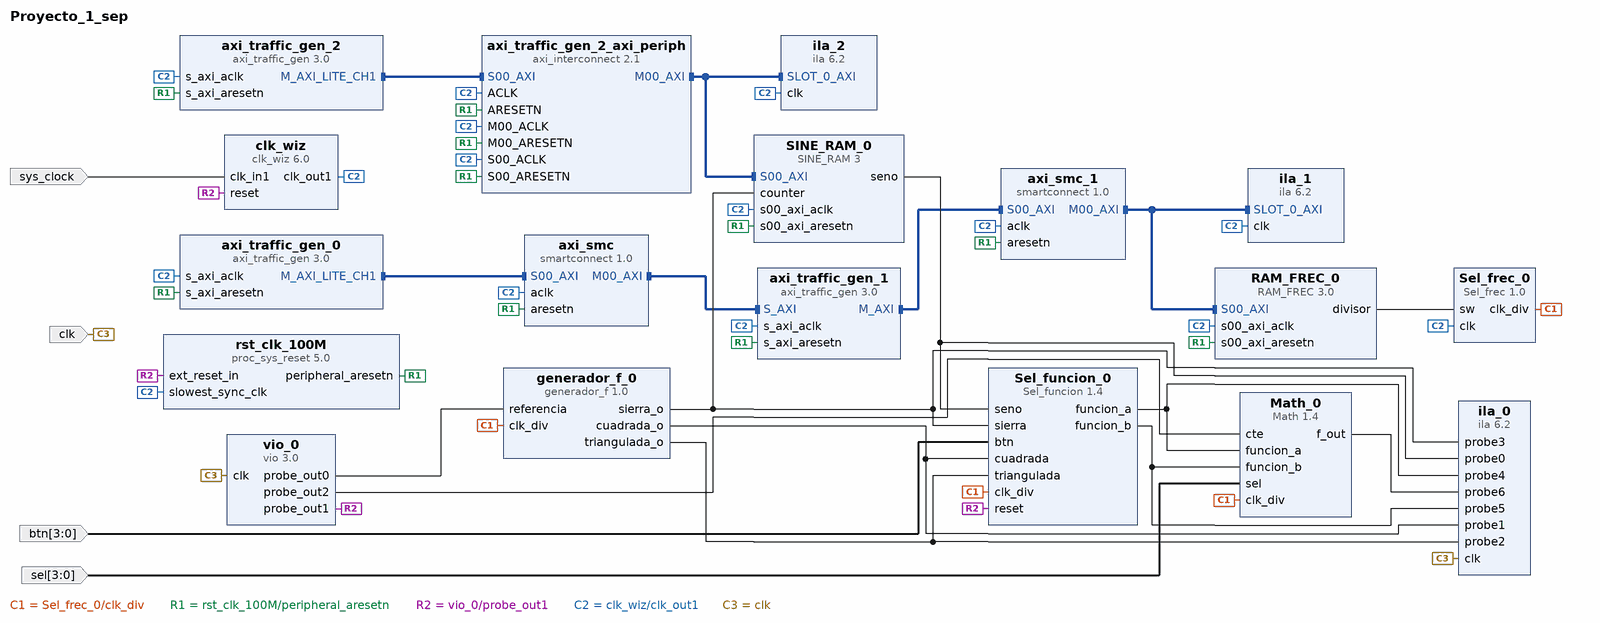
[diagram p0: block diagram of the top level]
# Vivado block design Proyecto_1_sep, xc7z010clg400-1, Vivado 2020.1
create_bd_design Proyecto_1_sep

create_bd_port -dir I -type clk clk
set_property -dict {CONFIG.FREQ_HZ 125000000} [get_bd_ports clk]
create_bd_port -dir I -from 3 -to 0 btn
create_bd_port -dir I -from 3 -to 0 sel
create_bd_port -dir I -type clk sys_clock
set_property -dict {CONFIG.FREQ_HZ 125000000 CONFIG.PHASE 0.000} [get_bd_ports sys_clock]

create_bd_cell -type ip -vlnv xilinx.com:user:Math:1.4 Math_0
create_bd_cell -type ip -vlnv xilinx.com:user:RAM_FREC:3.0 RAM_FREC_0
create_bd_cell -type ip -vlnv xilinx.com:user:SINE_RAM:3 SINE_RAM_0
create_bd_cell -type ip -vlnv xilinx.com:user:Sel_frec:1.0 Sel_frec_0
create_bd_cell -type ip -vlnv xilinx.com:user:Sel_funcion:1.4 Sel_funcion_0
create_bd_cell -type ip -vlnv xilinx.com:ip:axi_traffic_gen:3.0 axi_traffic_gen_0
set_property -dict [list \
  CONFIG.C_ATG_MIF_DATA_DEPTH 256 \
  CONFIG.C_ATG_MODE AXI4-Lite \
  CONFIG.C_ATG_SYSINIT_MODES System_Test \
  CONFIG.C_ATG_SYSTEM_CMD_MAX_RETRY 2147483647 \
  CONFIG.C_ATG_SYSTEM_INIT_ADDR_MIF {../../../../../../../Extras/coe adv/addr_adv.coe} \
  CONFIG.C_ATG_SYSTEM_INIT_CTRL_MIF {../../../../../../../Extras/coe adv/ctrl_adv.coe} \
  CONFIG.C_ATG_SYSTEM_INIT_DATA_MIF {../../../../../../../Extras/coe adv/data_adv.coe} \
  CONFIG.C_ATG_SYSTEM_INIT_MASK_MIF {../../../../../../../Extras/coe adv/mask_adv.coe} \
] [get_bd_cells axi_traffic_gen_0]
create_bd_cell -type ip -vlnv xilinx.com:ip:axi_traffic_gen:3.0 axi_traffic_gen_1
create_bd_cell -type ip -vlnv xilinx.com:ip:axi_traffic_gen:3.0 axi_traffic_gen_2
set_property -dict [list \
  CONFIG.C_ATG_MODE AXI4-Lite \
  CONFIG.C_ATG_SYSINIT_MODES System_Test \
  CONFIG.C_ATG_SYSTEM_CMD_MAX_RETRY 2147483647 \
  CONFIG.C_ATG_SYSTEM_INIT_ADDR_MIF {../../../../../../../Extras/coe lite/addr_sin.coe} \
  CONFIG.C_ATG_SYSTEM_INIT_CTRL_MIF {../../../../../../../Extras/coe lite/ctrl_sin.coe} \
  CONFIG.C_ATG_SYSTEM_INIT_DATA_MIF {../../../../../../../Extras/coe lite/data_sin.coe} \
  CONFIG.C_ATG_SYSTEM_INIT_MASK_MIF {../../../../../../../Extras/coe lite/mask_sin.coe} \
] [get_bd_cells axi_traffic_gen_2]
create_bd_cell -type ip -vlnv xilinx.com:ip:clk_wiz:6.0 clk_wiz
set_property -dict [list \
  CONFIG.CLKIN1_JITTER_PS 80.0 \
  CONFIG.CLKOUT1_JITTER 124.615 \
  CONFIG.CLKOUT1_PHASE_ERROR 96.948 \
  CONFIG.CLK_IN1_BOARD_INTERFACE sys_clock \
  CONFIG.MMCM_CLKFBOUT_MULT_F 8.000 \
  CONFIG.MMCM_CLKIN1_PERIOD 8.000 \
  CONFIG.USE_BOARD_FLOW true \
] [get_bd_cells clk_wiz]
create_bd_cell -type ip -vlnv xilinx.com:user:generador_f:1.0 generador_f_0
create_bd_cell -type ip -vlnv xilinx.com:ip:ila:6.2 ila_0
set_property -dict [list \
  CONFIG.C_ENABLE_ILA_AXI_MON false \
  CONFIG.C_MONITOR_TYPE Native \
  CONFIG.C_NUM_OF_PROBES 7 \
  CONFIG.C_PROBE0_WIDTH 8 \
  CONFIG.C_PROBE1_WIDTH 8 \
  CONFIG.C_PROBE2_WIDTH 8 \
  CONFIG.C_PROBE3_WIDTH 8 \
  CONFIG.C_PROBE4_WIDTH 8 \
  CONFIG.C_PROBE5_WIDTH 8 \
  CONFIG.C_PROBE6_WIDTH 16 \
] [get_bd_cells ila_0]
create_bd_cell -type ip -vlnv xilinx.com:ip:proc_sys_reset:5.0 rst_clk_100M
create_bd_cell -type ip -vlnv xilinx.com:ip:vio:3.0 vio_0
set_property -dict [list \
  CONFIG.C_NUM_PROBE_IN 0 \
  CONFIG.C_NUM_PROBE_OUT 3 \
  CONFIG.C_PROBE_IN0_WIDTH 8 \
  CONFIG.C_PROBE_IN2_WIDTH 8 \
  CONFIG.C_PROBE_OUT0_WIDTH 8 \
  CONFIG.C_PROBE_OUT2_WIDTH 8 \
] [get_bd_cells vio_0]
create_bd_cell -type ip -vlnv xilinx.com:ip:smartconnect:1.0 axi_smc_1
set_property -dict {CONFIG.NUM_SI 1} [get_bd_cells axi_smc_1]
create_bd_cell -type ip -vlnv xilinx.com:ip:axi_interconnect:2.1 axi_traffic_gen_2_axi_periph
set_property -dict {CONFIG.NUM_MI 1} [get_bd_cells axi_traffic_gen_2_axi_periph]
create_bd_cell -type ip -vlnv xilinx.com:ip:smartconnect:1.0 axi_smc
set_property -dict {CONFIG.NUM_SI 1} [get_bd_cells axi_smc]
create_bd_cell -type ip -vlnv xilinx.com:ip:ila:6.2 ila_1
set_property -dict [list \
  CONFIG.ALL_PROBE_SAME_MU true \
  CONFIG.ALL_PROBE_SAME_MU_CNT 1 \
  CONFIG.C_PROBE0_MU_CNT 1 \
  CONFIG.C_PROBE10_MU_CNT 1 \
  CONFIG.C_PROBE11_MU_CNT 1 \
  CONFIG.C_PROBE12_MU_CNT 1 \
  CONFIG.C_PROBE13_MU_CNT 1 \
  CONFIG.C_PROBE14_MU_CNT 1 \
  CONFIG.C_PROBE15_MU_CNT 1 \
  CONFIG.C_PROBE16_MU_CNT 1 \
  CONFIG.C_PROBE17_MU_CNT 1 \
  CONFIG.C_PROBE18_MU_CNT 1 \
  CONFIG.C_PROBE19_MU_CNT 1 \
  CONFIG.C_PROBE1_MU_CNT 1 \
  CONFIG.C_PROBE20_MU_CNT 1 \
  CONFIG.C_PROBE21_MU_CNT 1 \
  CONFIG.C_PROBE22_MU_CNT 1 \
  CONFIG.C_PROBE23_MU_CNT 1 \
  CONFIG.C_PROBE24_MU_CNT 1 \
  CONFIG.C_PROBE25_MU_CNT 1 \
  CONFIG.C_PROBE26_MU_CNT 1 \
  CONFIG.C_PROBE27_MU_CNT 1 \
  CONFIG.C_PROBE28_MU_CNT 1 \
  CONFIG.C_PROBE29_MU_CNT 1 \
  CONFIG.C_PROBE2_MU_CNT 1 \
  CONFIG.C_PROBE30_MU_CNT 1 \
  CONFIG.C_PROBE31_MU_CNT 1 \
  CONFIG.C_PROBE32_MU_CNT 1 \
  CONFIG.C_PROBE33_MU_CNT 1 \
  CONFIG.C_PROBE34_MU_CNT 1 \
  CONFIG.C_PROBE35_MU_CNT 1 \
  CONFIG.C_PROBE36_MU_CNT 1 \
  CONFIG.C_PROBE37_MU_CNT 1 \
  CONFIG.C_PROBE38_MU_CNT 1 \
  CONFIG.C_PROBE39_MU_CNT 1 \
  CONFIG.C_PROBE3_MU_CNT 1 \
  CONFIG.C_PROBE40_MU_CNT 1 \
  CONFIG.C_PROBE41_MU_CNT 1 \
  CONFIG.C_PROBE42_MU_CNT 1 \
  CONFIG.C_PROBE43_MU_CNT 1 \
  CONFIG.C_PROBE4_MU_CNT 1 \
  CONFIG.C_PROBE5_MU_CNT 1 \
  CONFIG.C_PROBE6_MU_CNT 1 \
  CONFIG.C_PROBE7_MU_CNT 1 \
  CONFIG.C_PROBE8_MU_CNT 1 \
  CONFIG.C_PROBE9_MU_CNT 1 \
] [get_bd_cells ila_1]
create_bd_cell -type ip -vlnv xilinx.com:ip:ila:6.2 ila_2
set_property -dict [list \
  CONFIG.ALL_PROBE_SAME_MU true \
  CONFIG.ALL_PROBE_SAME_MU_CNT 1 \
  CONFIG.C_PROBE0_MU_CNT 1 \
  CONFIG.C_PROBE10_MU_CNT 1 \
  CONFIG.C_PROBE11_MU_CNT 1 \
  CONFIG.C_PROBE12_MU_CNT 1 \
  CONFIG.C_PROBE13_MU_CNT 1 \
  CONFIG.C_PROBE14_MU_CNT 1 \
  CONFIG.C_PROBE15_MU_CNT 1 \
  CONFIG.C_PROBE16_MU_CNT 1 \
  CONFIG.C_PROBE17_MU_CNT 1 \
  CONFIG.C_PROBE18_MU_CNT 1 \
  CONFIG.C_PROBE19_MU_CNT 1 \
  CONFIG.C_PROBE1_MU_CNT 1 \
  CONFIG.C_PROBE20_MU_CNT 1 \
  CONFIG.C_PROBE21_MU_CNT 1 \
  CONFIG.C_PROBE22_MU_CNT 1 \
  CONFIG.C_PROBE23_MU_CNT 1 \
  CONFIG.C_PROBE24_MU_CNT 1 \
  CONFIG.C_PROBE25_MU_CNT 1 \
  CONFIG.C_PROBE26_MU_CNT 1 \
  CONFIG.C_PROBE27_MU_CNT 1 \
  CONFIG.C_PROBE28_MU_CNT 1 \
  CONFIG.C_PROBE29_MU_CNT 1 \
  CONFIG.C_PROBE2_MU_CNT 1 \
  CONFIG.C_PROBE30_MU_CNT 1 \
  CONFIG.C_PROBE31_MU_CNT 1 \
  CONFIG.C_PROBE32_MU_CNT 1 \
  CONFIG.C_PROBE33_MU_CNT 1 \
  CONFIG.C_PROBE34_MU_CNT 1 \
  CONFIG.C_PROBE35_MU_CNT 1 \
  CONFIG.C_PROBE36_MU_CNT 1 \
  CONFIG.C_PROBE37_MU_CNT 1 \
  CONFIG.C_PROBE38_MU_CNT 1 \
  CONFIG.C_PROBE39_MU_CNT 1 \
  CONFIG.C_PROBE3_MU_CNT 1 \
  CONFIG.C_PROBE40_MU_CNT 1 \
  CONFIG.C_PROBE41_MU_CNT 1 \
  CONFIG.C_PROBE42_MU_CNT 1 \
  CONFIG.C_PROBE43_MU_CNT 1 \
  CONFIG.C_PROBE4_MU_CNT 1 \
  CONFIG.C_PROBE5_MU_CNT 1 \
  CONFIG.C_PROBE6_MU_CNT 1 \
  CONFIG.C_PROBE7_MU_CNT 1 \
  CONFIG.C_PROBE8_MU_CNT 1 \
  CONFIG.C_PROBE9_MU_CNT 1 \
] [get_bd_cells ila_2]

# ---- connections ----

connect_bd_intf_net [get_bd_intf_pins axi_traffic_gen_2/M_AXI_LITE_CH1] [get_bd_intf_pins axi_traffic_gen_2_axi_periph/S00_AXI]
connect_bd_intf_net [get_bd_intf_pins axi_smc/M00_AXI] [get_bd_intf_pins axi_traffic_gen_1/S_AXI]
connect_bd_intf_net [get_bd_intf_pins axi_traffic_gen_0/M_AXI_LITE_CH1] [get_bd_intf_pins axi_smc/S00_AXI]
connect_bd_intf_net [get_bd_intf_pins axi_smc_1/M00_AXI] [get_bd_intf_pins RAM_FREC_0/S00_AXI]
connect_bd_intf_net [get_bd_intf_pins axi_smc_1/M00_AXI] [get_bd_intf_pins ila_1/SLOT_0_AXI]
connect_bd_intf_net [get_bd_intf_pins axi_traffic_gen_2_axi_periph/M00_AXI] [get_bd_intf_pins SINE_RAM_0/S00_AXI]
connect_bd_intf_net [get_bd_intf_pins axi_traffic_gen_2_axi_periph/M00_AXI] [get_bd_intf_pins ila_2/SLOT_0_AXI]
connect_bd_intf_net [get_bd_intf_pins axi_traffic_gen_1/M_AXI] [get_bd_intf_pins axi_smc_1/S00_AXI]
connect_bd_net [get_bd_pins Sel_frec_0/clk_div] [get_bd_pins Math_0/clk_div] [get_bd_pins Sel_funcion_0/clk_div] [get_bd_pins generador_f_0/clk_div]
connect_bd_net -net Dientes_de_sierra_0_sierra [get_bd_pins generador_f_0/sierra_o] \
  [get_bd_pins SINE_RAM_0/counter] [get_bd_pins Sel_funcion_0/sierra] [get_bd_pins ila_0/probe3]
connect_bd_net -net RAM_test_0_seno [get_bd_pins SINE_RAM_0/seno] [get_bd_pins Sel_funcion_0/seno] [get_bd_pins ila_0/probe0]
connect_bd_net -net comp_cuadrada_0_cuadrada [get_bd_pins generador_f_0/cuadrada_o] [get_bd_pins Sel_funcion_0/cuadrada] [get_bd_pins ila_0/probe1]
connect_bd_net -net Triangular_0_triangulada [get_bd_pins generador_f_0/triangulada_o] \
  [get_bd_pins Sel_funcion_0/triangulada] [get_bd_pins ila_0/probe2]
connect_bd_net -net btn_0_1 [get_bd_ports btn] [get_bd_pins Sel_funcion_0/btn]
connect_bd_net [get_bd_pins Sel_funcion_0/funcion_a] [get_bd_pins Math_0/funcion_a] [get_bd_pins ila_0/probe4]
connect_bd_net [get_bd_pins Sel_funcion_0/funcion_b] [get_bd_pins Math_0/funcion_b] [get_bd_pins ila_0/probe5]
connect_bd_net [get_bd_pins vio_0/probe_out2] [get_bd_pins Math_0/cte]
connect_bd_net -net sel_0_1 [get_bd_ports sel] [get_bd_pins Math_0/sel]
connect_bd_net [get_bd_pins Math_0/f_out] [get_bd_pins ila_0/probe6]
connect_bd_net [get_bd_pins vio_0/probe_out0] [get_bd_pins generador_f_0/referencia]
connect_bd_net [get_bd_pins RAM_FREC_0/divisor] [get_bd_pins Sel_frec_0/sw]
connect_bd_net [get_bd_pins rst_clk_100M/peripheral_aresetn] \
  [get_bd_pins RAM_FREC_0/s00_axi_aresetn] [get_bd_pins SINE_RAM_0/s00_axi_aresetn] \
  [get_bd_pins axi_traffic_gen_0/s_axi_aresetn] [get_bd_pins axi_traffic_gen_1/s_axi_aresetn] \
  [get_bd_pins axi_traffic_gen_2/s_axi_aresetn] [get_bd_pins axi_smc_1/aresetn] \
  [get_bd_pins axi_traffic_gen_2_axi_periph/S00_ARESETN] [get_bd_pins axi_traffic_gen_2_axi_periph/M00_ARESETN] \
  [get_bd_pins axi_traffic_gen_2_axi_periph/ARESETN] [get_bd_pins axi_smc/aresetn]
connect_bd_net [get_bd_pins vio_0/probe_out1] [get_bd_pins Sel_funcion_0/reset] [get_bd_pins clk_wiz/reset] [get_bd_pins rst_clk_100M/ext_reset_in]
connect_bd_net [get_bd_pins clk_wiz/clk_out1] \
  [get_bd_pins axi_traffic_gen_0/s_axi_aclk] [get_bd_pins axi_smc/aclk] [get_bd_pins axi_traffic_gen_1/s_axi_aclk] \
  [get_bd_pins axi_smc_1/aclk] [get_bd_pins axi_traffic_gen_2/s_axi_aclk] [get_bd_pins axi_traffic_gen_2_axi_periph/S00_ACLK] \
  [get_bd_pins axi_traffic_gen_2_axi_periph/ACLK] [get_bd_pins axi_traffic_gen_2_axi_periph/M00_ACLK] \
  [get_bd_pins SINE_RAM_0/s00_axi_aclk] [get_bd_pins RAM_FREC_0/s00_axi_aclk] [get_bd_pins rst_clk_100M/slowest_sync_clk] \
  [get_bd_pins Sel_frec_0/clk] [get_bd_pins ila_1/clk] [get_bd_pins ila_2/clk]
connect_bd_net [get_bd_ports sys_clock] [get_bd_pins clk_wiz/clk_in1]
connect_bd_net [get_bd_ports clk] [get_bd_pins ila_0/clk] [get_bd_pins vio_0/clk]

# ---- address map ----
assign_bd_address -offset 0x44A00000 -range 64K -target_address_space [get_bd_addr_spaces axi_traffic_gen_0/Reg1] [get_bd_addr_segs axi_traffic_gen_1/S_AXI/Reg0]
assign_bd_address -offset 0x76000000 -range 64K -target_address_space [get_bd_addr_spaces axi_traffic_gen_1/Data] [get_bd_addr_segs RAM_FREC_0/S00_AXI/S00_AXI_mem]
assign_bd_address -offset 0x44A00000 -range 64K -target_address_space [get_bd_addr_spaces axi_traffic_gen_2/Reg1] [get_bd_addr_segs SINE_RAM_0/S00_AXI/S00_AXI_reg]

validate_bd_design
save_bd_design
